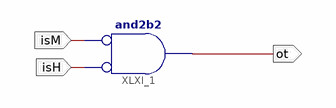
[diagram p0: schematic sheet 1]
// Xilinx ISE schematic SSDbc.sch (xc9500xl) as structural Verilog: 1 symbols, 3 ports
module SSDbc (
  input  isH,
  input  isM,
  output ot
);

  and XLXI_1 (ot, ~isH, ~isM);  // and2b2
endmodule
